# Altium schematic sheet S7CAS-PLEIADES-CARTE-MERE_P20_Arbre_Alimentation.SchDoc
size Tabloid; Sheet_Name: Arbre d'alimentation; Size: 11x17
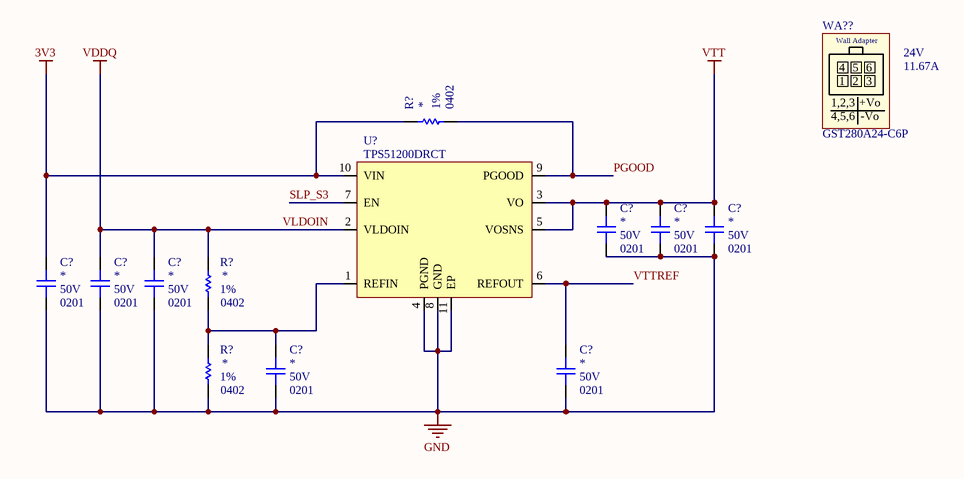
[diagram p0: S7CAS-PLEIADES-CARTE-MERE_P20_Arbre_Alimentation.SchDoc]

## Parts
(Parts that share a designator on the sheet are numbered #1, #2 ... from top to bottom, then left to right.)
C?#1  Voltage: 50V  Package: 0201  [CAP_0201]  (hidden comment: CAP - 0201)
C?#2  Voltage: 50V  Package: 0201  [CAP_0201]  (hidden comment: CAP - 0201)
C?#3  Voltage: 50V  Package: 0201  [CAP_0201]  (hidden comment: CAP - 0201)
C?#4  Voltage: 50V  Package: 0201  [CAP_0201]  (hidden comment: CAP - 0201)
C?#5  Voltage: 50V  Package: 0201  [CAP_0201]  (hidden comment: CAP - 0201)
C?#6  Voltage: 50V  Package: 0201  [CAP_0201]  (hidden comment: CAP - 0201)
C?#7  Voltage: 50V  Package: 0201  [CAP_0201]  (hidden comment: CAP - 0201)
C?#8  Voltage: 50V  Package: 0201  [CAP_0201]  (hidden comment: CAP - 0201)
R?#1  Package: 0402  Precision: 1%  [RES_0402]  (hidden comment: RES - 0402)
R?#2  Package: 0402  Precision: 1%  [RES_0402]  (hidden comment: RES - 0402)
R?#3  Package: 0402  Precision: 1%  [RES_0402]  (hidden comment: RES - 0402)
U?  TPS51200DRCT  [REG_PMIC_TPS51200DRCT]
WA??  GST280A24-C6P  value 24V  Current Rating: 11.67A  [Model Name]  (mechanical)

## Nets
3V3: C?#4.2 R?#1.2 U?.10(VIN)
GND: C?#1.1 C?#2.1 C?#3.1 C?#4.1 C?#5.1 C?#6.1 C?#7.1 C?#8.1 R?#3.1 U?.4(PGND) U?.8(GND) U?.11(EP)
VLDOIN: C?#5.2 C?#6.2 R?#2.2 U?.2(VLDOIN)  [also labelled VDDQ]
VTT: C?#1.2 C?#2.2 C?#3.2 U?.3(VO) U?.5(VOSNS)
PGOOD: R?#1.1 U?.9(PGOOD)
SLP_S3: U?.7(EN)
VTTREF: C?#8.2 U?.6(REFOUT)
NetC?#7_2: C?#7.2 R?#2.1 R?#3.2 U?.1(REFIN)

## Notes on the sheet
- Sheet Name
- Project Title
- Global Project
- Size
- Group
- Revision
- Date
- Sheet
- of
- Filename
- Designers
- (in symbol UND_GST280A24-C6P) Wall Adapter; 4; 5; 6; 1; 2; 3; 1,2,3; +Vo; 4,5,6; -Vo

## Library data of the parts
C?#1-C?#8 = CAP - 0201: Precision: 10%; Current: *; CreatedBy: Jonathan Bouchard; Power: *; Value: *
R?#1-R?#3 = RES - 0402: Voltage: 50V; Power: 1/16W; Current: *; CreatedBy: Jonathan Bouchard; Value: *
U? = REG_PMIC_TPS51200DRCT: REG - DDR TERMINATION/REF REG - 10-VFDFN; Manufacturer #1: Texas Instruments; Value: DDR, DDR2, DDR3(L), DDR4; Voltage Rating: 2.375V ~ 3.5V; Current Rating: Source: 3A~4.5A, Sink: 3.5A~5.5A; GRAMS Lib Spec: 2.8; Magnetic Material: Unknown; Polarized: Yes; Tolerance: *; Power Max: *; HelpURL: http://www.ti.com/lit/ds/symlink/tps51200.pdf; CreatedBy/Date: Joel Lemay 2019-03-19; VerifiedBy: Nicolas V. (2019-05-31); Temperature: -40°C ~ 85°C; Package: 10-VFDFN; Manufacturer #2: *; Note: *; Assembly Type: SMD; Part Number #2: *; Part Number #1: TPS51200DRCT; Supplier 1: Digi-Key; Supplier Part Number 1: 296-23830-1-ND; Cryo: UNKNOWN
WA?? = UND_GST280A24-C6P: UND - AC/DC DESKTOP ADAPTER 24V 280W - MEC; Manufacturer #1: MEAN WELL USA Inc.; Tolerance: ±3%; Voltage Rating: 85~264VAC; GRAMS Lib Spec: 2.8; Magnetic Material: Unknown; Polarized: Yes; Power Max: 280W; HelpURL: https://www.meanwell.com/Upload/PDF/GST280A/GST280A-SPEC.PDF; CreatedBy/Date: Caroline Paulin - 5 avril 2019; VerifiedBy: Nicolas V. (2019-07-05); Temperature: -30°C to +70°C; Package: -; Manufacturer #2: *; Note: *; Assembly Type: -; Part Number #2: *; Part Number #1: GST280A24-C6P; Supplier 1: Digi-Key; Supplier Part Number 1: 1866-2122-ND; Cryo: UNKNOWN